# EAGLE schematic External Diagram FSAE 2022 (EAGLE 9.6.2)
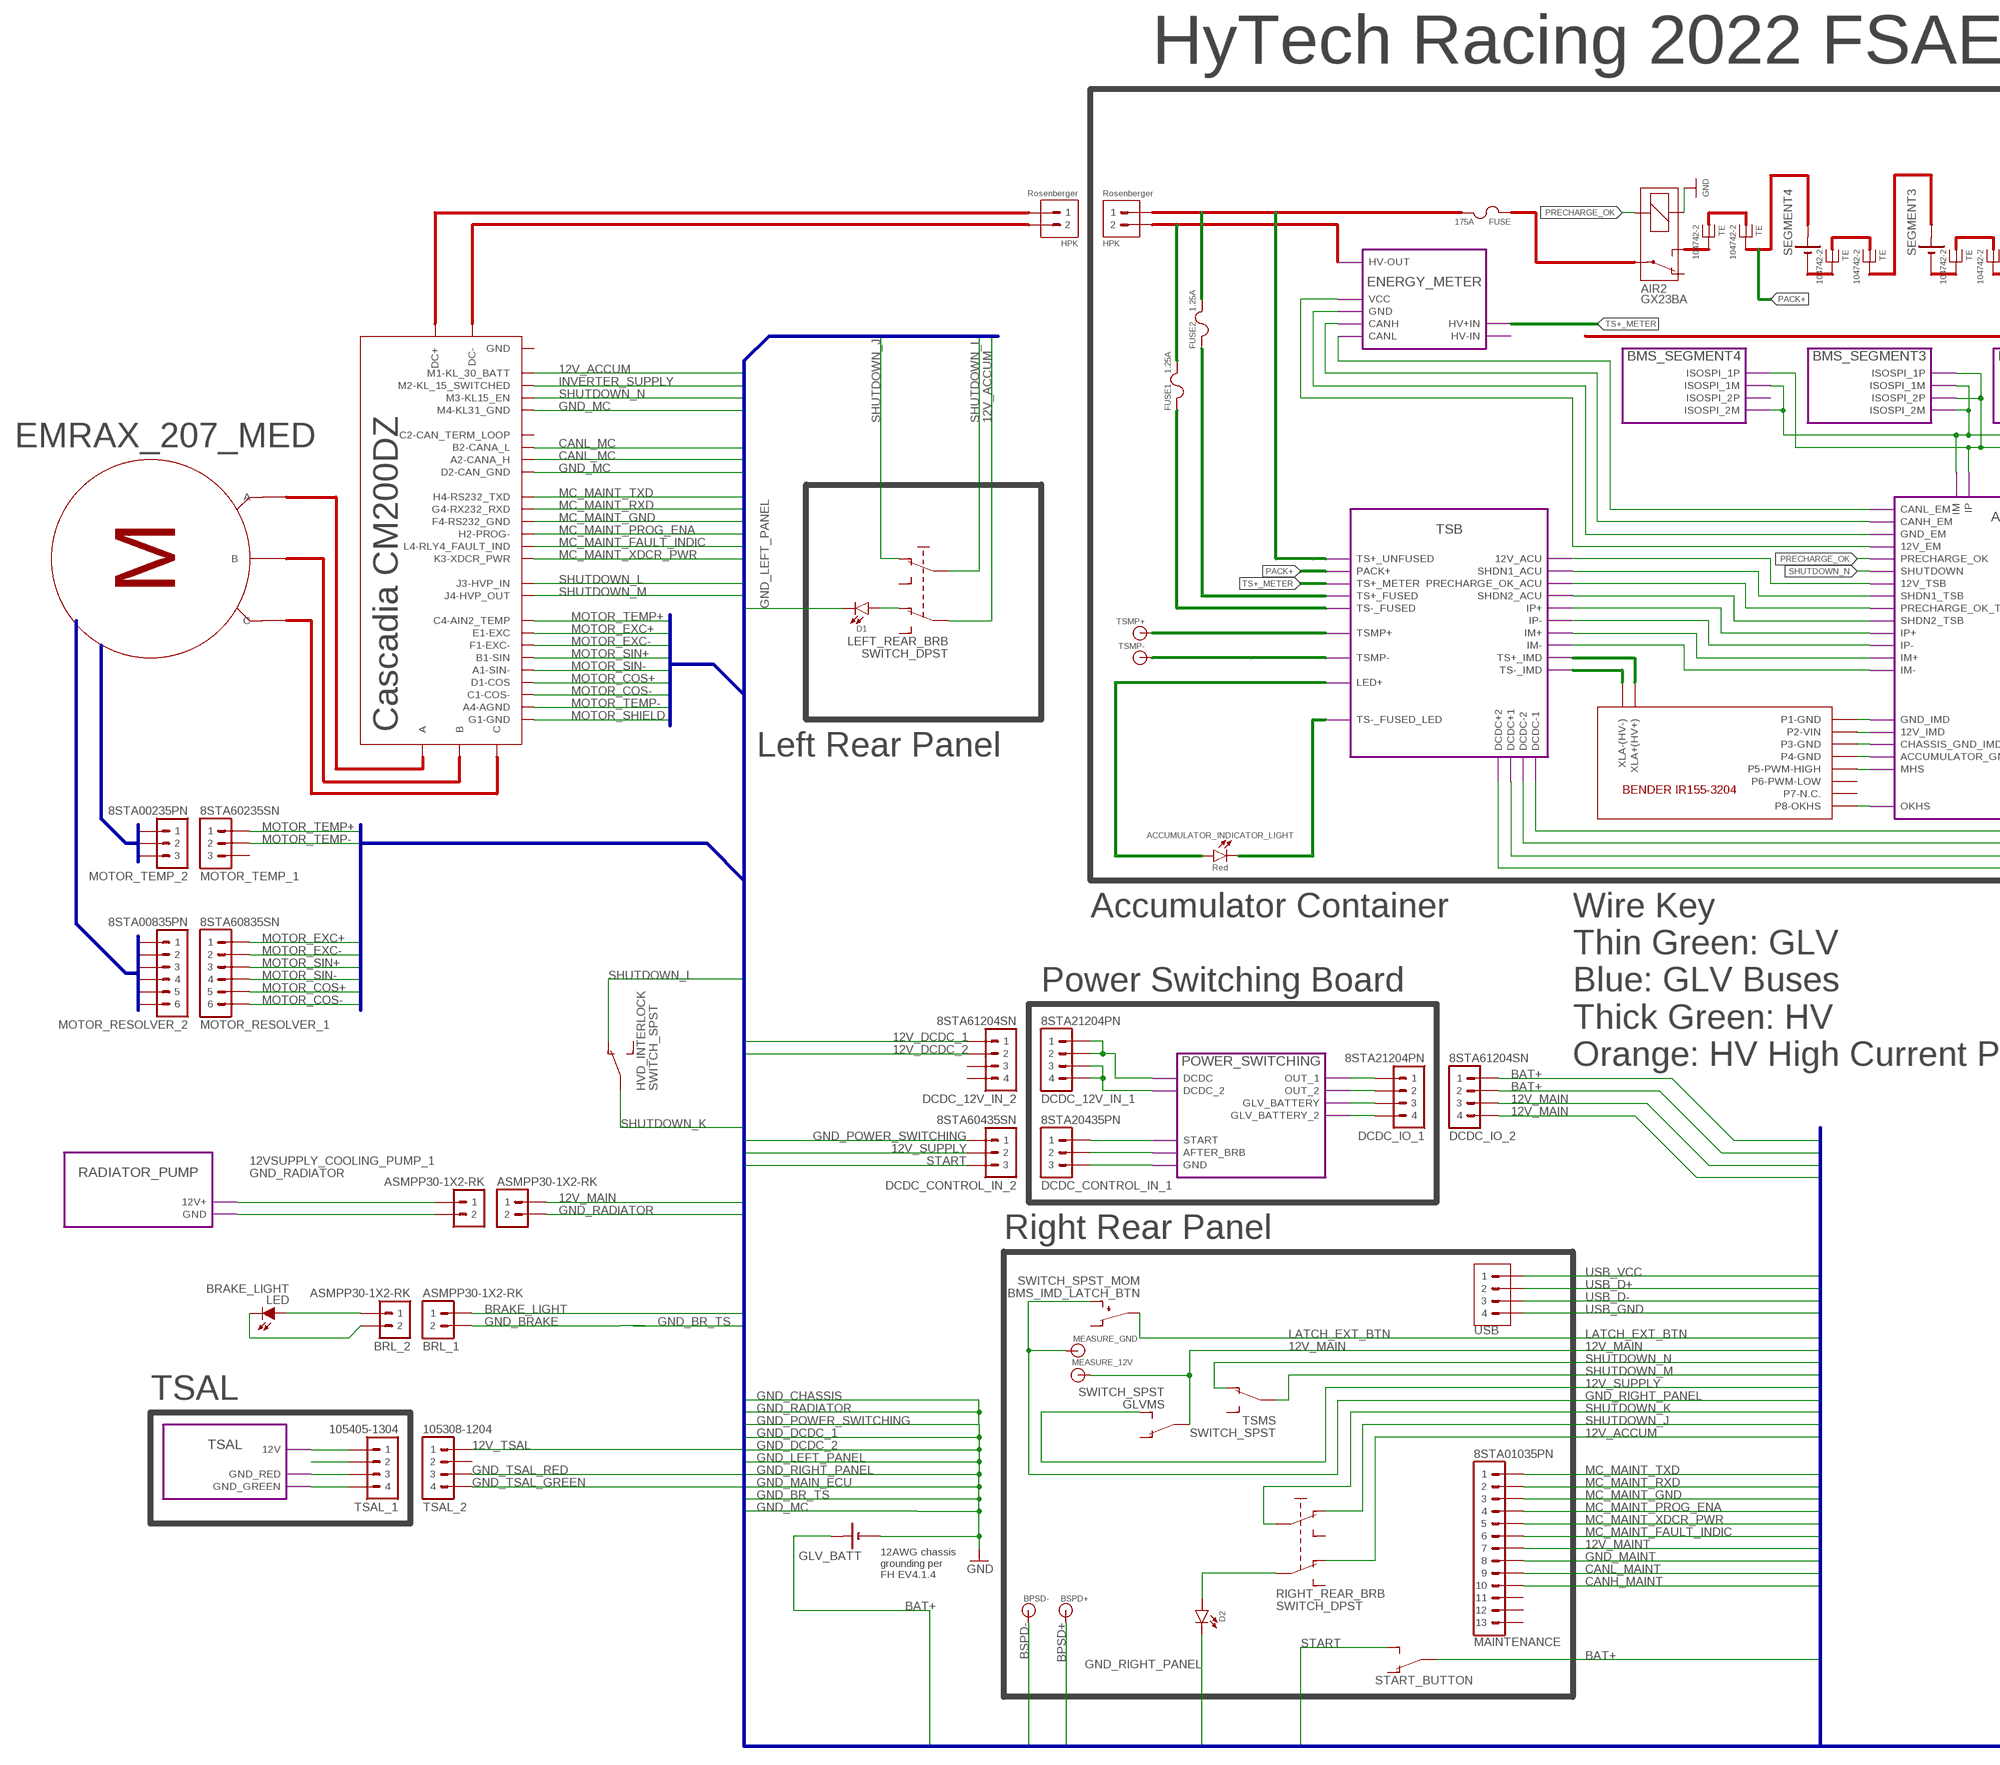
[diagram p0: schematic, sheet 1, part 1 of 2]
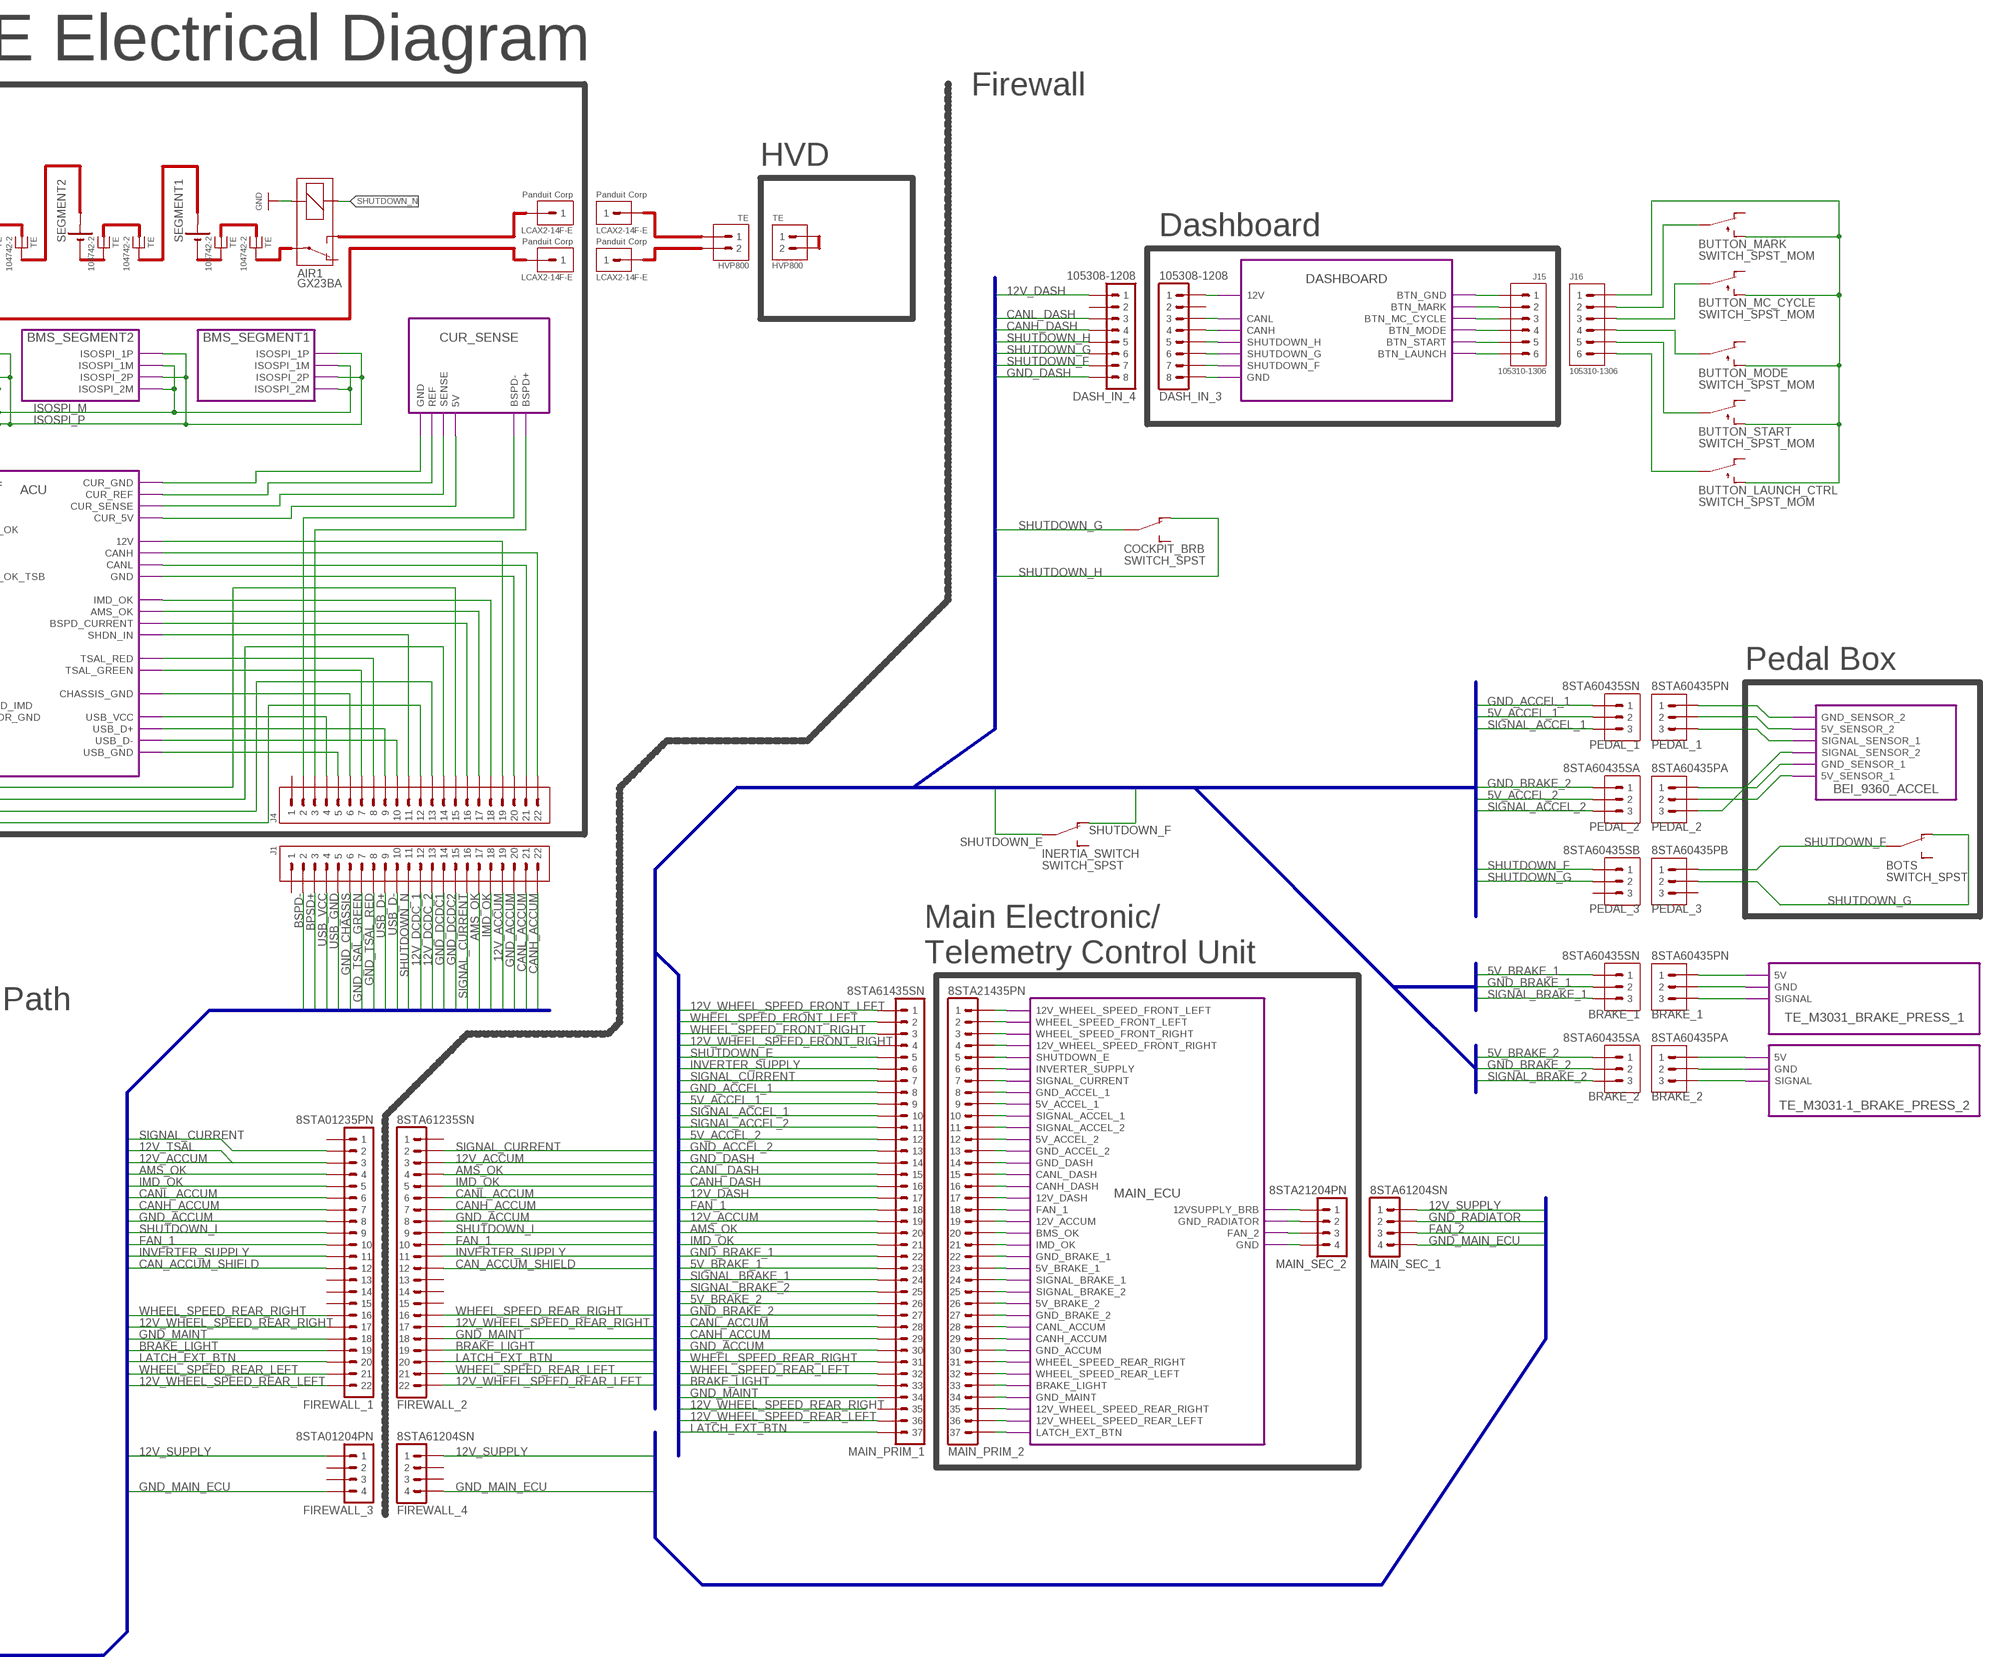
[diagram p1: schematic, sheet 1, part 2 of 2]

## Parts
A1  CASCADIA_CM200DZ  (no package)
ACCUMULATOR_INDICATOR_LIGHT  LED_0603_RED  [0603-LED]
AIR1  GX23BA  RELAY  (no package)
AIR2  GX23BA  RELAY  (no package)
BMS_IMD_LATCH_BTN  SWITCH_SPST_MOM  (no package)
BOTS  SWITCH_SPST  (no package)
BPSD-  BANANA_JACK  (no package)
BRAKE_LIGHT  LED  (no package)
BRL_1  ASMPP30-1X2-RK  M02  (no package)
BRL_2  ASMPP30-1X2-RK  M02  (no package)
BSPD+  BANANA_JACK  (no package)
BUTTON_LAUNCH_CTRL  SWITCH_SPST_MOM  (no package)
BUTTON_MARK  SWITCH_SPST_MOM  (no package)
BUTTON_MC_CYCLE  SWITCH_SPST_MOM  (no package)
BUTTON_MODE  SWITCH_SPST_MOM  (no package)
BUTTON_START  SWITCH_SPST_MOM  (no package)
COCKPIT_BRB  SWITCH_SPST  (no package)
D1  DIODE_LED  (no package)
D2  DIODE_LED  (no package)
DASH_IN_3  105308-1208  M08  (no package)
DASH_IN_4  105308-1208  M08  (no package)
DCDC_12V_IN_1  8STA21204PN  M04  (no package)
DCDC_12V_IN_2  8STA61204SN  M04  (no package)
DCDC_CONTROL_IN_1  8STA20435PN  M03  (no package)
DCDC_CONTROL_IN_2  8STA60435SN  M03  (no package)
DCDC_IO_1  8STA21204PN  M04  (no package)
DCDC_IO_2  8STA61204SN  M04  (no package)
EMRAX_207_MED  MOTOR_AC  (no package)
FIREWALL_1  8STA01235PN  M22  (no package)
FIREWALL_2  8STA61235SN  M22  (no package)
FIREWALL_3  8STA01204PN  M04  (no package)
FIREWALL_4  8STA61204SN  M04  (no package)
FUSE  175A  FUSE  (no package)
FUSE1  1.25A  FUSE  (no package)
FUSE2  1.25A  FUSE  (no package)
GLV_BATT  BATTERY_1_CELL  (no package)
GLVMS  SWITCH_SPST  (no package)
HVD_INTERLOCK  SWITCH_SPST  (no package)
INERTIA_SWITCH  SWITCH_SPST  (no package)
J1  CONNECTOR-22_SOURIAU_  [SOURIAU_12-35]
J2  CONNECTOR-4_  (no package)
J3  CONNECTOR-2_HVP800  (no package)
J4  CONNECTOR-22_SOURIAU_  [SOURIAU_12-35]
J5  CONNECTOR-3_  (no package)
J6  CONNECTOR-3_  (no package)
J7  CONNECTOR-3_  (no package)
J8  CONNECTOR-3_  (no package)
J9  CONNECTOR-3_  (no package)
J10  CONNECTOR-3_  (no package)
J11  CONNECTOR-3_  (no package)
J12  CONNECTOR-3_  (no package)
J13  CONNECTOR-3_  (no package)
J14  CONNECTOR-3_  (no package)
J15  CONNECTOR-6_NF_T_V_BLACK  [MOLEX_NANOFIT_PTH_06]
J16  CONNECTOR-6_NF_T_V_BLACK  [MOLEX_NANOFIT_PTH_06]
J17  CONNECTOR-2_HPK  (no package)
J18  CONNECTOR-2_HPK  (no package)
J19  CONNECTOR-1_LCAX2-14F-E  (no package)
J20  CONNECTOR-1_LCAX2-14F-E  (no package)
J21  CONNECTOR-1_LCAX2-14F-E  (no package)
J22  CONNECTOR-1_LCAX2-14F-E  (no package)
J23  CONNECTOR-2_HVP800  (no package)
LEFT_REAR_BRB  SWITCH_DPST  (no package)
MAIN_PRIM_1  8STA61435SN  M37  (no package)
MAIN_PRIM_2  8STA21435PN  M37  (no package)
MAIN_SEC_1  8STA61204SN  M04  (no package)
MAIN_SEC_2  8STA21204PN  M04  (no package)
MAINTENANCE  8STA01035PN  M13  (no package)
MEASURE_12V  BANANA_JACK  (no package)
MEASURE_GND  BANANA_JACK  (no package)
MOTOR_RESOLVER_1  8STA60835SN  M06  (no package)
MOTOR_RESOLVER_2  8STA00835PN  M06  (no package)
MOTOR_TEMP_1  8STA60235SN  M03  (no package)
MOTOR_TEMP_2  8STA00235PN  M03  (no package)
PUMP_1  ASMPP30-1X2-RK  M02  (no package)
PUMP_2  ASMPP30-1X2-RK  M02  (no package)
RIGHT_REAR_BRB  SWITCH_DPST  (no package)
S1  SWITCH_SPST_  (no package)
SEGMENT1  BATTERY_1_CELL  (no package)
SEGMENT2  BATTERY_1_CELL  (no package)
SEGMENT3  BATTERY_1_CELL  (no package)
SEGMENT4  BATTERY_1_CELL  (no package)
TSAL_1  105405-1304  M04  (no package)
TSAL_2  105308-1204  M04  (no package)
TSMP+  BANANA_JACK  (no package)
TSMP-  BANANA_JACK  (no package)
TSMS  SWITCH_SPST  (no package)
U$1  MAINTENANCE_PLUG_104742-2  (no package)
U$2  BENDER_IR155-3204  (no package)
U$3  MAINTENANCE_PLUG_104742-2  (no package)
U$4  MAINTENANCE_PLUG_104742-2  (no package)
U$5  MAINTENANCE_PLUG_104742-2  (no package)
U$6  MAINTENANCE_PLUG_104742-2  (no package)
U$7  MAINTENANCE_PLUG_104742-2  (no package)
U$8  MAINTENANCE_PLUG_104742-2  (no package)
U$9  MAINTENANCE_PLUG_104742-2  (no package)
U$10  MAINTENANCE_PLUG_104742-2  (no package)
U$11  MAINTENANCE_PLUG_104742-2  (no package)

## Module instances
BMS_SEGMENT2 = BMS_SEGMENT
BMS_SEGMENT3 = BMS_SEGMENT
BMS_SEGMENT4 = BMS_SEGMENT
RADIATOR_PUMP = COOLING_MODULE
MAIN_ECU = MAIN_ECU
BEI_9360_ACCEL = BEI_9360
TE_M3031_BRAKE_PRESS_1 = TE_M3031
POWER_SWITCHING = POWER_SWITCHING
TE_M3031-1_BRAKE_PRESS_2 = TE_M3031
ENERGY_METER = ENERGY_METER
ACU = ACU
DASHBOARD = DASHBOARD
BMS_SEGMENT1 = BMS_SEGMENT
TSB = TSB
TSAL = TSAL
CUR_SENSE = CUR_SENSE

## Nets
5V_ACCEL_1: J11.2 MAIN_PRIM_1.9 MAIN_PRIM_2.27 ; port MAIN_ECU.GND_BRAKE_2
5V_ACCEL_2: J12.2 MAIN_PRIM_1.12 MAIN_PRIM_2.28 ; port MAIN_ECU.CANL_ACCUM
5V_BRAKE: MAIN_PRIM_2.29 ; port MAIN_ECU.CANH_ACCUM
5V_BRAKE_1: J7.1 MAIN_PRIM_1.23
5V_BRAKE_2: J8.1 MAIN_PRIM_1.26
12V_ACCUM: A1.M1-KL_30_BATT FIREWALL_1.3 FIREWALL_2.3 J1.19 LEFT_REAR_BRB.P1 MAIN_PRIM_1.19 MAIN_PRIM_2.10 RIGHT_REAR_BRB.O1 ; port MAIN_ECU.SIGNAL_ACCEL_1
12V_DASH: DASH_IN_4.1 MAIN_PRIM_1.17 MAIN_PRIM_2.34 ; port MAIN_ECU.GND_MAINT
12V_DCDC_1: DCDC_12V_IN_2.1 J1.12
12V_DCDC_2: DCDC_12V_IN_2.2 J1.13
12V_MAIN: DCDC_IO_2.3 DCDC_IO_2.4 GLVMS.P MEASURE_12V.1 PUMP_1.1
12V_MAINT: MAINTENANCE.7
12V_SUPPLY: DCDC_CONTROL_IN_2.2 FIREWALL_3.1 FIREWALL_4.1 GLVMS.S MAIN_SEC_1.1 MAIN_SEC_2.1 ; port MAIN_ECU.12VSUPPLY_BRB
12V_TSAL: TSAL_2.1
12V_WHEEL_SPEED_FRONT_LEFT: MAIN_PRIM_1.1
12V_WHEEL_SPEED_FRONT_RIGHT: MAIN_PRIM_1.4
12V_WHEEL_SPEED_REAR_LEFT: FIREWALL_1.22 FIREWALL_2.22 MAIN_PRIM_1.36
12V_WHEEL_SPEED_REAR_RIGHT: FIREWALL_1.17 FIREWALL_2.17
12VSUPPLY_COOLING_PUMP_1: PUMP_2.1 ; port RADIATOR_PUMP.12V+
AMS_OK: FIREWALL_1.4 FIREWALL_2.4 J1.17 MAIN_PRIM_1.20
BAT+: DCDC_IO_2.1 DCDC_IO_2.2 GLV_BATT.+ S1.P
BPSD+: BSPD+.1 J1.3
BRAKE_LIGHT: BRAKE_LIGHT.C BRL_1.1 BRL_2.2 FIREWALL_1.19 FIREWALL_2.19 MAIN_PRIM_1.33 MAIN_PRIM_2.9 MAIN_PRIM_2.33 ; port MAIN_ECU.5V_ACCEL_1 MAIN_ECU.BRAKE_LIGHT
BSPD-: BPSD-.1 J1.2
CAN_ACCUM_SHIELD: FIREWALL_1.12 FIREWALL_2.12
CANH_ACCUM: FIREWALL_1.7 FIREWALL_2.7 J1.22 MAIN_PRIM_1.29 MAIN_PRIM_2.13 ; port MAIN_ECU.GND_ACCEL_2
CANH_DASH: DASH_IN_4.4 MAIN_PRIM_1.16
CANH_MAINT: MAINTENANCE.10
CANH_MC: MAIN_PRIM_2.12 ; port MAIN_ECU.5V_ACCEL_2
CANL_ACCUM: FIREWALL_1.6 FIREWALL_2.6 J1.21 MAIN_PRIM_1.28 MAIN_PRIM_2.26 ; port MAIN_ECU.5V_BRAKE_2
CANL_DASH: DASH_IN_4.3 MAIN_PRIM_1.15
CANL_MAINT: MAINTENANCE.9
CANL_MC: A1.A2-CANA_H A1.B2-CANA_L MAIN_PRIM_2.11 ; port MAIN_ECU.SIGNAL_ACCEL_2
DASH_1: MAIN_PRIM_2.1 ; port MAIN_ECU.12V_WHEEL_SPEED_FRONT_LEFT
DASH_4: MAIN_PRIM_2.4 ; port MAIN_ECU.12V_WHEEL_SPEED_FRONT_RIGHT
DASH_5: MAIN_PRIM_2.18 ; port MAIN_ECU.FAN_1
DASH_6: MAIN_PRIM_2.19 ; port MAIN_ECU.12V_ACCUM
DASH_8: MAIN_PRIM_2.21 ; port MAIN_ECU.IMD_OK
DASH_9: MAIN_PRIM_2.23 ; port MAIN_ECU.5V_BRAKE_1
DASH_11: MAIN_PRIM_2.6 ; port MAIN_ECU.INVERTER_SUPPLY
DASH_12: MAIN_PRIM_2.22 ; port MAIN_ECU.GND_BRAKE_1
FAN_1: FIREWALL_1.10 FIREWALL_2.10 MAIN_PRIM_1.18
FAN_2: MAIN_SEC_1.3 MAIN_SEC_2.3 ; port MAIN_ECU.FAN_2
GND: AIR1.2 AIR2.1 MAIN_SEC_2.4 ; port MAIN_ECU.GND
GND_ACCEL_1: J11.1 MAIN_PRIM_1.8 MAIN_PRIM_2.14 ; port MAIN_ECU.GND_DASH
GND_ACCEL_2: MAIN_PRIM_1.13 MAIN_PRIM_2.15 ; port MAIN_ECU.CANL_DASH
GND_ACCUM: FIREWALL_1.8 FIREWALL_2.8 J1.20 MAIN_PRIM_1.30 MAIN_PRIM_2.30 ; port MAIN_ECU.GND_ACCUM
GND_AUX: MAIN_PRIM_2.36 ; port MAIN_ECU.12V_WHEEL_SPEED_REAR_LEFT
GND_BR: BRAKE_LIGHT.A BRL_2.1
GND_BRAKE: BRL_1.2 MAIN_PRIM_2.16 ; port MAIN_ECU.CANH_DASH
GND_BRAKE_1: J7.2 MAIN_PRIM_1.22
GND_BRAKE_2: J8.2 J12.1 MAIN_PRIM_1.27
GND_CHASSIS: J1.6
GND_CURRENT: MAIN_SEC_2.2 ; port MAIN_ECU.GND_RADIATOR
GND_DASH: DASH_IN_4.8 MAIN_PRIM_1.14
GND_DCDC1: J1.14
GND_DCDC2: J1.15
GND_DCDC_2: GLV_BATT.- ; supply symbol labelled GND
GND_LEFT_PANEL: D1.C
GND_MAIN_ECU: FIREWALL_3.4 FIREWALL_4.4 MAIN_SEC_1.4
GND_MAINT: FIREWALL_1.18 FIREWALL_2.18 MAIN_PRIM_1.34 MAINTENANCE.8
GND_MC: A1.D2-CAN_GND A1.M4-KL31_GND
GND_POWER_SWITCHING: DCDC_CONTROL_IN_2.1
GND_RADIATOR: MAIN_SEC_1.2 PUMP_1.2 PUMP_2.2 ; port RADIATOR_PUMP.GND
GND_RIGHT_PANEL: BMS_IMD_LATCH_BTN.S D2.C MEASURE_GND.1
GND_TSAL_GREEN: J1.7 TSAL_2.4
GND_TSAL_RED: J1.8 TSAL_2.3
IMD_OK: FIREWALL_1.5 FIREWALL_2.5 J1.18 MAIN_PRIM_1.21
INVERTER_SUPPLY: A1.M2-KL_15_SWITCHED FIREWALL_1.11 FIREWALL_2.11 MAIN_PRIM_1.6 MAIN_PRIM_2.7 ; port MAIN_ECU.SIGNAL_CURRENT
ISOSPI_M: port BMS_SEGMENT2.ISOSPI_1M BMS_SEGMENT2.ISOSPI_2M BMS_SEGMENT4.ISOSPI_2M BMS_SEGMENT4.ISOSPI_1M BMS_SEGMENT3.ISOSPI_2M BMS_SEGMENT3.ISOSPI_1M ACU.IM
ISOSPI_P: port BMS_SEGMENT2.ISOSPI_1P BMS_SEGMENT2.ISOSPI_2P BMS_SEGMENT4.ISOSPI_1P BMS_SEGMENT3.ISOSPI_1P BMS_SEGMENT3.ISOSPI_2P ACU.IP
LATCH_EXT_BTN: BMS_IMD_LATCH_BTN.P FIREWALL_1.20 FIREWALL_2.20 MAIN_PRIM_1.37 MAIN_PRIM_2.37 ; port MAIN_ECU.LATCH_EXT_BTN
MC_MAINT_FAULT_INDIC: A1.L4-RLY4_FAULT_IND MAINTENANCE.6
MC_MAINT_GND: A1.F4-RS232_GND MAINTENANCE.3
MC_MAINT_PROG_ENA: A1.H2-PROG- MAINTENANCE.4
MC_MAINT_RXD: A1.G4-RX232_RXD MAINTENANCE.2
MC_MAINT_TXD: A1.H4-RS232_TXD MAINTENANCE.1
MC_MAINT_XDCR_PWR: A1.K3-XDCR_PWR MAINTENANCE.5
MOTOR_COS+: A1.D1-COS MOTOR_RESOLVER_1.5
MOTOR_COS-: A1.C1-COS- MOTOR_RESOLVER_1.6
MOTOR_EXC+: A1.E1-EXC MOTOR_RESOLVER_1.1
MOTOR_EXC-: A1.F1-EXC- MOTOR_RESOLVER_1.2
MOTOR_SHIELD: A1.G1-GND
MOTOR_SIN+: A1.B1-SIN MOTOR_RESOLVER_1.3
MOTOR_SIN-: A1.A1-SIN- MOTOR_RESOLVER_1.4
MOTOR_TEMP+: A1.C4-AIN2_TEMP MOTOR_TEMP_1.1
MOTOR_TEMP-: A1.A4-AGND MOTOR_TEMP_1.2
N$1: BUTTON_START.P J16.5
N$2: ACCUMULATOR_INDICATOR_LIGHT.2(A) ; port TSB.LED+
N$3: TSAL_1.1
N$4: TSAL_1.2
N$5: J4.4 ; port ACU.USB_VCC
N$6: J4.13 ; port TSB.DCDC+1
N$7: D1.A LEFT_REAR_BRB.O1
N$8: port ACU.12V_TSB TSB.12V_ACU
N$9: port ACU.SHDN1_TSB TSB.SHDN1_ACU
N$10: J4.15 ; port TSB.DCDC-1
N$11: J4.12 ; port TSB.DCDC+2
N$12: J5.1 ; port TE_M3031_BRAKE_PRESS_1.5V
N$13: J5.2 ; port TE_M3031_BRAKE_PRESS_1.GND
N$14: J5.3 ; port TE_M3031_BRAKE_PRESS_1.SIGNAL
N$15: DASH_IN_3.1 ; port DASHBOARD.12V
N$16: J6.1 ; port TE_M3031-1_BRAKE_PRESS_2.5V
N$17: D2.A RIGHT_REAR_BRB.P1
N$18: DASH_IN_3.3 ; port DASHBOARD.CANL
N$19: DASH_IN_3.4 ; port DASHBOARD.CANH
N$20: ACCUMULATOR_INDICATOR_LIGHT.1(C) ; port TSB.TS-_FUSED_LED
N$21: DASH_IN_3.5 ; port DASHBOARD.SHUTDOWN_H
N$22: DASH_IN_3.6 ; port DASHBOARD.SHUTDOWN_G
N$23: DASH_IN_3.7 ; port DASHBOARD.SHUTDOWN_F
N$25: J4.5 ; port ACU.USB_GND
N$26: J4.14 ; port TSB.DCDC-2
N$27: J15.1 ; port DASHBOARD.BTN_GND
N$28: J15.2 ; port DASHBOARD.BTN_MARK
N$29: J15.3 ; port DASHBOARD.BTN_MC_CYCLE
N$30: J15.4 ; port DASHBOARD.BTN_MODE
N$31: J15.5 ; port DASHBOARD.BTN_START
N$32: J15.6 ; port DASHBOARD.BTN_LAUNCH
N$35: port ACU.PRECHARGE_OK_TSB TSB.PRECHARGE_OK_ACU
N$36: J9.1 ; port BEI_9360_ACCEL.GND_SENSOR_2
N$37: J6.2 ; port TE_M3031-1_BRAKE_PRESS_2.GND
N$38: port ACU.SHDN2_TSB TSB.SHDN2_ACU
N$39: J4.3 ; port CUR_SENSE.BSPD+
N$40: J4.2 ; port CUR_SENSE.BSPD-
N$41: BUTTON_MODE.P J16.4
N$42: port ACU.IP+ TSB.IP+
N$43: BUTTON_MC_CYCLE.P J16.3
N$44: port ACU.IP- TSB.IP-
N$45: port ACU.IM+ TSB.IM+
N$46: port ACU.IM- TSB.IM-
N$47: BUTTON_LAUNCH_CTRL.S BUTTON_MARK.S BUTTON_MC_CYCLE.S BUTTON_MODE.S BUTTON_START.S J16.1
N$48: BUTTON_MARK.P J16.2
N$49: BUTTON_LAUNCH_CTRL.P J16.6
N$50: J6.3 ; port TE_M3031-1_BRAKE_PRESS_2.SIGNAL
N$51: J9.2 ; port BEI_9360_ACCEL.5V_SENSOR_2
N$52: J9.3 ; port BEI_9360_ACCEL.SIGNAL_SENSOR_1
N$53: J10.1 ; port BEI_9360_ACCEL.GND_SENSOR_1
N$54: J4.9 ; port ACU.USB_D+
N$55: J10.2 ; port BEI_9360_ACCEL.5V_SENSOR_1
N$56: J10.3 ; port BEI_9360_ACCEL.SIGNAL_SENSOR_2
N$57: DASH_IN_3.8 ; port DASHBOARD.GND
N$58: J4.10 ; port ACU.USB_D-
N$59: J4.6 ; port ACU.CHASSIS_GND
N$60: port ENERGY_METER.VCC ACU.12V_EM
N$61: FUSE2.2
N$62: FUSE1.2
N$63: FUSE2.1 ; port TSB.TS+_FUSED
N$64: DCDC_12V_IN_1.3 DCDC_12V_IN_1.4 ; port POWER_SWITCHING.DCDC_2
N$65: DCDC_12V_IN_1.1 DCDC_12V_IN_1.2 ; port POWER_SWITCHING.DCDC
N$66: DCDC_IO_1.1 ; port POWER_SWITCHING.OUT_1
N$67: DCDC_IO_1.2 ; port POWER_SWITCHING.OUT_2
N$68: FUSE1.1 ; port TSB.TS-_FUSED
N$69: DCDC_CONTROL_IN_1.3 ; port POWER_SWITCHING.GND
N$70: DCDC_CONTROL_IN_1.2 ; port POWER_SWITCHING.AFTER_BRB
N$71: DCDC_CONTROL_IN_1.1 ; port POWER_SWITCHING.START
N$72: U$2.XLA+(HV+) ; port TSB.TS+_IMD
N$73: DCDC_IO_1.3 ; port POWER_SWITCHING.GLV_BATTERY
N$74: J4.11 ; port ACU.SHDN_IN
N$75: port ACU.CUR_5V CUR_SENSE.5V
N$76: U$2.XLA-(HV-) ; port TSB.TS-_IMD
N$77: MAIN_PRIM_2.35 ; port MAIN_ECU.12V_WHEEL_SPEED_REAR_RIGHT
N$78: port ENERGY_METER.CANL ACU.CANL_EM
N$79: TSMP+.1 ; port TSB.TSMP+
N$80: DCDC_IO_1.4 ; port POWER_SWITCHING.GLV_BATTERY_2
N$81: TSAL_1.3
N$82: TSAL_1.4
N$83: J4.7 ; port ACU.TSAL_GREEN
N$84: J4.8 ; port ACU.TSAL_RED
N$86: J4.16 ; port ACU.BSPD_CURRENT
N$87: J4.17 ; port ACU.AMS_OK
N$88: J4.18 ; port ACU.IMD_OK
N$89: J4.19 ; port ACU.12V
N$90: J4.22 ; port ACU.CANH
N$91: J4.21 ; port ACU.CANL
N$92: J4.20 ; port ACU.GND
N$97: U$2.P1-GND ; port ACU.GND_IMD
N$98: U$2.P2-VIN ; port ACU.12V_IMD
N$99: U$2.P3-GND ; port ACU.CHASSIS_GND_IMD
N$100: U$2.P4-GND ; port ACU.ACCUMULATOR_GND
N$101: U$2.P5-PWM-HIGH ; port ACU.MHS
N$102: U$2.P8-OKHS ; port ACU.OKHS
N$103: TSMP-.1 ; port TSB.TSMP-
N$104: port ENERGY_METER.GND ACU.GND_EM
N$105: port ENERGY_METER.CANH ACU.CANH_EM
N$106: port ACU.CUR_SENSE CUR_SENSE.SENSE
N$107: port ACU.CUR_REF CUR_SENSE.REF
N$108: port ACU.CUR_GND CUR_SENSE.GND
PACK+: port TSB.PACK+
PRECHARGE_OK: AIR2.2 ; port ACU.PRECHARGE_OK
RET_FAN_1: MAIN_PRIM_2.17 ; port MAIN_ECU.12V_DASH
SHUTDOWN_E: INERTIA_SWITCH.P MAIN_PRIM_1.5 MAIN_PRIM_2.5 ; port MAIN_ECU.SHUTDOWN_E
SHUTDOWN_F: BOTS.P DASH_IN_4.7 INERTIA_SWITCH.O J13.1 J14.1
SHUTDOWN_G: BOTS.O COCKPIT_BRB.P DASH_IN_4.6 J13.2 J14.2
SHUTDOWN_H: COCKPIT_BRB.O DASH_IN_4.5
SHUTDOWN_I: FIREWALL_1.9 FIREWALL_2.9 LEFT_REAR_BRB.P
SHUTDOWN_J: LEFT_REAR_BRB.O RIGHT_REAR_BRB.O
SHUTDOWN_K: HVD_INTERLOCK.P RIGHT_REAR_BRB.P
SHUTDOWN_L: A1.J3-HVP_IN HVD_INTERLOCK.O
SHUTDOWN_M: A1.J4-HVP_OUT TSMS.P
SHUTDOWN_N: A1.M3-KL15_EN AIR1.1 J1.11 TSMS.O ; port ACU.SHUTDOWN
SIGNAL_ACCEL_1: J11.3 MAIN_PRIM_1.10
SIGNAL_ACCEL_2: J12.3 MAIN_PRIM_1.11
SIGNAL_BRAKE: MAIN_PRIM_2.8 ; port MAIN_ECU.GND_ACCEL_1
SIGNAL_BRAKE_1: J7.3 MAIN_PRIM_1.24 MAIN_PRIM_2.24 ; port MAIN_ECU.SIGNAL_BRAKE_1
SIGNAL_BRAKE_2: J8.3 MAIN_PRIM_1.25 MAIN_PRIM_2.25 ; port MAIN_ECU.SIGNAL_BRAKE_2
SIGNAL_CURRENT: FIREWALL_1.2 FIREWALL_2.2 J1.16 MAIN_PRIM_1.7
START: DCDC_CONTROL_IN_2.3 S1.S
TS+_METER: port TSB.TS+_METER ENERGY_METER.HV+IN
TS+_UNFUSED: port TSB.TS+_UNFUSED
USB_D+: J1.9 J2.2
USB_D-: J1.10 J2.3
USB_GND: J1.5 J2.4
USB_VCC: J1.4 J2.1
WHEEL_SPEED_2: MAIN_PRIM_2.2 MAIN_PRIM_2.3 ; port MAIN_ECU.WHEEL_SPEED_FRONT_LEFT MAIN_ECU.WHEEL_SPEED_FRONT_RIGHT
WHEEL_SPEED_3: MAIN_PRIM_2.20 MAIN_PRIM_2.31 ; port MAIN_ECU.WHEEL_SPEED_REAR_RIGHT MAIN_ECU.BMS_OK
WHEEL_SPEED_4: MAIN_PRIM_2.32 ; port MAIN_ECU.WHEEL_SPEED_REAR_LEFT
WHEEL_SPEED_FRONT_LEFT: MAIN_PRIM_1.2
WHEEL_SPEED_FRONT_RIGHT: MAIN_PRIM_1.3
WHEEL_SPEED_REAR_LEFT: FIREWALL_1.21 FIREWALL_2.21 MAIN_PRIM_1.32
WHEEL_SPEED_REAR_RIGHT: FIREWALL_1.16 FIREWALL_2.16 MAIN_PRIM_1.31
Unconnected: A1.A A1.B A1.C A1.C2-CAN_TERM_LOOP A1.DC+ A1.DC- A1.GND AIR1.O AIR1.P AIR1.S AIR2.O AIR2.P AIR2.S BMS_IMD_LATCH_BTN.O BOTS.S BUTTON_LAUNCH_CTRL.O BUTTON_MARK.O BUTTON_MC_CYCLE.O BUTTON_MODE.O BUTTON_START.O COCKPIT_BRB.S DASH_IN_3.2 DASH_IN_4.2 DCDC_12V_IN_2.3 DCDC_12V_IN_2.4 EMRAX_207_MED.A EMRAX_207_MED.B EMRAX_207_MED.C FIREWALL_1.1 FIREWALL_1.13 FIREWALL_1.14 FIREWALL_1.15 FIREWALL_2.1 FIREWALL_2.13 FIREWALL_2.14 FIREWALL_2.15 FIREWALL_3.2 FIREWALL_3.3 FIREWALL_4.2 FIREWALL_4.3 FUSE.1 FUSE.2 GLVMS.O HVD_INTERLOCK.S INERTIA_SWITCH.S J1.1 J3.1 J3.2 J4.1 J13.3 J14.3 J17.1 J17.2 J18.1 J18.2 J19.1 J20.1 J21.1 J22.1 J23.1 J23.2 LEFT_REAR_BRB.S LEFT_REAR_BRB.S1 MAIN_PRIM_1.35 MAINTENANCE.11 MAINTENANCE.12 MAINTENANCE.13 MOTOR_RESOLVER_2.1 MOTOR_RESOLVER_2.2 MOTOR_RESOLVER_2.3 MOTOR_RESOLVER_2.4 MOTOR_RESOLVER_2.5 MOTOR_RESOLVER_2.6 MOTOR_TEMP_1.3 MOTOR_TEMP_2.1 MOTOR_TEMP_2.2 MOTOR_TEMP_2.3 RIGHT_REAR_BRB.S RIGHT_REAR_BRB.S1 S1.O SEGMENT1.+ SEGMENT1.- SEGMENT2.+ SEGMENT2.- SEGMENT3.+ SEGMENT3.- SEGMENT4.+ SEGMENT4.- TSAL_2.2 TSMS.S U$1.1 U$1.P$1 U$2.P6-PWM-LOW U$2.P7-N.C. U$3.1 U$3.P$1 U$4.1 U$4.P$1 U$5.1 U$5.P$1 U$6.1 U$6.P$1 U$7.1 U$7.P$1 U$8.1 U$8.P$1 U$9.1 U$9.P$1 U$10.1 U$10.P$1 U$11.1 U$11.P$1

## Buses
5V_ACCEL_1,5V_ACCEL_2,5V_BRAKE,5V_BRAKE_1,5V_BRAKE_2,12V_ACCUM_MAINT,12V_AFTER_LEFT_BRB,12V_DASH,12V_DCDC_1,12V_DCDC_2,12V_MAIN,12V_MAINT,12V_MC,12V_SUPPLY,12VSUPPLY_COOLING_FAN_1,12VSUPPLY_COOLING_FAN_2,12VSUPPLY_COOLING_FAN_3,12VSUPPLY_COOLING_PUMP_1,12VSUPPLY_COOLING_UNSWITCHED,12VSUPPLY_UNSWITCHED,12V_TSAL,12V_WHEEL_SPEED_FRONT_LEFT,12V_WHEEL_SPEED_FRONT_RIGHT,12V_WHEEL_SPEED_REAR_LEFT,12V_WHEEL_SPEED_REAR_RIGHT,60V_THRESHOLD,60V_THRESHOLD_1,60V_THRESHOLD_2,AMS_OK,BAT+,BPSD+,BRAKE_LIGHT,BSPD-,CAN_ACCUM_SHIELD,CANH_ACCUM,CANH_DASH,CANH_FRONT,CANH_MAINT,CANH_MC,CANL_ACCUM,CANL_DASH,CANL_MAINT,CANL_MC,CHARGE_ENABLE,CUR_SENSE_5V,CUR_SENSE_CUR_SENSE,CUR_SENSE_GND,CUR_SENSE_REF,DASH_1,DASH_4,DASH_5,DASH_8,DASH_9,DASH_11,DASH_12,FAN_1,FAN_2,GND,GND_ACCEL_1,GND_ACCEL_2,GND_ACCUM,GND_AUX,GND_BR,GND_BRAKE,GND_BRAKE_1,GND_BRAKE_2,GND_BR_TS,GND_CHASSIS,GND_CURRENT,GND_DASH,GND_DCDC1,GND_DCDC_1,GND_DCDC_2,GND_DCDC2,GND_DCDC_4,GND_LEFT_PANEL,GND_MAIN_ECU,GND_MAINT,GND_MC,GND_POWER_SWITCHING,GND_RIGHT_PANEL,GND_SHIELD,GND_TSAL_GREEN,GND_TSAL_RED,HV+,HV-,HV+FUSED,HV-FUSED,IMD_GND,IMD_HV+,IMD_HV-,IMD_OK,IMD_SUPPLY,INVERTER_SUPPLY,ISOSPI_M,ISOSPI_P,LATCH_EXT_BTN,MC_MAINT_FAULT_INDIC,MC_MAINT_GND,MC_MAINT_PROG_ENA,MC_MAINT_RXD,MC_MAINT_TXD,MC_MAINT_XDCR_PWR,MOTOR_COS-,MOTOR_COS+,MOTOR_EXC-,MOTOR_EXC+,MOTOR_SHIELD,MOTOR_SIN-,MOTOR_SIN+,MOTOR_TEMP+,MOTOR_TEMP-,RET_FAN_1,SHUTDOWN_E,SHUTDOWN_F,SHUTDOWN_G,SHUTDOWN_H,SHUTDOWN_I,SHUTDOWN_J,SHUTDOWN_K,SHUTDOWN_K_OUT,SHUTDOWN_L,SHUTDOWN_M,SHUTDOWN_N,SIGNAL_ACCEL_1,SIGNAL_ACCEL_2,SIGNAL_BRAKE,SIGNAL_BRAKE_1,SIGNAL_BRAKE_2,SIGNAL_CURRENT,SSOK,START,USB_D-,USB_D+,USB_GND,USB_VCC,WHEEL_SPEED_2,WHEEL_SPEED_3,WHEEL_SPEED_4,WHEEL_SPEED_FRONT_LEFT,WHEEL_SPEED_FRONT_RIGHT,WHEEL_SPEED_REAR_LEFT,WHEEL_SPEED_REAR_RIGHT
B$1
B$2
HT:5V_ACCEL_1,5V_ACCEL_2,5V_BRAKE,12V_ACCUM,12V_ACCUM_MAINT,12V_DASH,12V_MAINT,12V_SUPPLY,12VSUPPLY_COOLING_FAN_1,12VSUPPLY_COOLING_FAN_2,12VSUPPLY_COOLING_PUMP_1,12VSUPPLY_COOLING_UNSWITCHED,12VSUPPLY_UNSWITCHED,BAT+,BRAKE_LIGHT,CANH_ACCUM,CANH_FRONT,CANH_MAINT,CANH_MC,CANL_ACCUM,CANL_FRONT,CANL_MAINT,CANL_MC,CHARGE_ENABLE,DASH_1,DASH_4,DASH_5,DASH_6,DASH_8,DASH_9,DASH_12,FAN_2,GND_ACCEL_1,GND_ACCEL_2,GND_ACCUM,GND_ACCUM_RELAYS,GND_BRAKE,GND_BR_TS,GND_CURRENT,GND_DASH,GND_LEFT_PANEL,GND_MAIN_ECU,GND_MAINT,GND_MC,GND_RIGHT_PANEL,GND_SHIELD,INVERTER_SUPPLY,LATCH_EXT_BTN,MC_MAINT_GND,MC_MAINT_PROG_ENA,MC_MAINT_RXD,MC_MAINT_TXD,MC_MAINT_XDCR_PWR,MOTOR_COS-,MOTOR_COS+,MOTOR_EXC-,MOTOR_EXC+,MOTOR_SHIELD,MOTOR_SIN+,MOTOR_SIN-,MOTOR_TEMP+,MOTOR_TEMP-,RET_FAN_1,SHUTDOWN_F,SHUTDOWN_G,SIGNAL_BRAKE,SIGNAL_BRAKE_1,SIGNAL_BRAKE_2,SSOK,TSAL,WHEEL_SPEED_2,WHEEL_SPEED_3,WHEEL_SPEED_4

## Notes on the sheet
- HyTech Racing 2022 FSAE Electrical Diagram
- Firewall
- HVD
- Dashboard
- Pedal Box
- 8STA60435SN | 8STA60435PN
- Left Rear Panel
- PEDAL_1 | PEDAL_1
- 8STA60435SA | 8STA60435PA
- PEDAL_2 | PEDAL_2
- 8STA60435SB | 8STA60435PB
- Accumulator Container
- PEDAL_3 | PEDAL_3
- Power Switching Board
- 8STA60435SN | 8STA60435PN
- Main Electronic/
  Telemetry Control Unit
- Wire Key
  Thin Green: GLV
  Blue: GLV Buses
  Thick Green: HV
  Orange: HV High Current Path
- BRAKE_1 | BRAKE_1
- 8STA60435SA | 8STA60435PA
- BRAKE_2 | BRAKE_2
- Right Rear Panel
- USB
- TSAL | GND_CHASSIS
- GND_RADIATOR
- 12AWG chassis
  grounding per
  FH EV4.1.4
- START_BUTTON

## Library data of the parts
A1 = HyTechSymbolsTemp:CASCADIA_CM200DZ: Cascaida Motion CM200DZ Motor Inverter Product Page <https://www.cascadiamotion.com/productlist/8-inverters/pm-inverters/49-cm200> Datasheet <https://www.cascadiamotion.com/images/catalog/DataSheets/CM200.pdf>
ACCUMULATOR_INDICATOR_LIGHT = HyTechDevices:LED_?_*: LED Blue <https://www.mouser.com/datasheet/2/216/APT1608VBC_D-246010.pdf> Green <https://www.mouser.com/datasheet/2/216/APT1608ZGCK-1173388.pdf> Orange <https://www.mouser.com/datasheet/2/216/APT1608SECK-6197.pdf> Red <https://www.mouser.com/datasheet/2/216/APT1608SECK-J3-PRV-1173336.pdf> White <https://www.mouser.com/datasheet/2/50/SM0603UWC-880813.pdf> Yellow <https://www.mouser.com/datasheet/2/216/APT1608SYCK-J3-PRV-1173311.pdf>; COLOR: Red; DKPN: 754-1786-1-ND; MANUFACTURER: Kingbright; MOPN: 604-APT1608SECKJ3PRV; MPN: APT1608SECK/J3-PRV
AIR1 AIR2 = HyTechSymbols:RELAY: RELAY 1 x switch
BMS_IMD_LATCH_BTN BUTTON_LAUNCH_CTRL BUTTON_MARK BUTTON_MC_CYCLE BUTTON_MODE BUTTON_START = HyTechSymbols:SWITCH_SPST_MOM: Single Pull Single Throw Switch Momentary
BOTS COCKPIT_BRB GLVMS HVD_INTERLOCK INERTIA_SWITCH TSMS = HyTechSymbols:SWITCH_SPST: Single Pull Single Throw Switch
BPSD- BSPD+ MEASURE_12V MEASURE_GND TSMP+ TSMP- = HyTechSymbols:BANANA_JACK: Banana Jack Purchasing: Mouser - Red <http://www.mouser.com/ProductDetail/Pomona-Electronics/72930-2/?qs=2nDnb8a6ouM2t6dPw1JBow%3D%3D> Mouser - Black <http://www.mouser.com/ProductDetail/Pomona-Electronics/72930-0/?qs=2nDnb8a6ouNpA2wl9kKnzA%3D%3D>
BRAKE_LIGHT = HyTechSymbols:LED: Generic LED
BRL_1 BRL_2 PUMP_1 PUMP_2 = HyTechSymbols:M02: Generic 2-pin connector
D1 D2 = HyTechSymbolsTemp:DIODE_LED
DASH_IN_3 DASH_IN_4 = HyTechSymbols:M08: Generic 8-pin connector
DCDC_12V_IN_1 DCDC_12V_IN_2 DCDC_IO_1 DCDC_IO_2 FIREWALL_3 FIREWALL_4 MAIN_SEC_1 MAIN_SEC_2 TSAL_1 TSAL_2 = HyTechSymbols:M04: Generic 4-pin connector
DCDC_CONTROL_IN_1 DCDC_CONTROL_IN_2 MOTOR_TEMP_1 MOTOR_TEMP_2 = HyTechSymbols:M03: Generic 3-pin connector
EMRAX_207_MED = HyTechSymbols:MOTOR_AC: Generic three-phase AC electric motor
FIREWALL_1 FIREWALL_2 = HyTechSymbols:M22: Generic 22-pin connector
FUSE FUSE1 FUSE2 = HyTechSymbols:FUSE: Generic Fuse
GLV_BATT SEGMENT1-SEGMENT4 = HyTechSymbols:BATTERY_1_CELL: Generic 1-cell battery Source: Sonnenschein
J1 J4 = HyTechDevicesTemp:CONNECTOR-22_?_*: 22 pin connector; MANUFACTURER: SOURIAU
J2 = HyTechSymbolsTemp:CONNECTOR-4_*: Four pin connector Micro-Fit 3.0 <https://drive.google.com/file/d/1Be8WGxzm3IeOWSN4qfSP8J4bwHUWCwaO/view>
J3 J23 = HyTechSymbolsTemp:CONNECTOR-2_*: Two pin connector EVH2-N2TK-TDA <https://drive.google.com/file/d/1gQfuywpa-Tm7bohh-tcSjjxbyqcnD_h9/view> HPK <https://drive.google.com/file/d/1jTQMZ26zoHotHQHZYMoMT2jUzRt664sO/view> HVP800 <https://drive.google.com/file/d/1j-HswfqYHj8usJ9E3bf8NWBzB-X0BKJ4/view>; MANUFACTURER: TE; MPN: HVP800
J5-J14 = HyTechSymbolsTemp:CONNECTOR-3_*: Three pin connector HV02-M3S(40A)-M00A-1 <https://drive.google.com/file/d/14-0BdluqhzWVuxobIuHQclYd8S9S8AFy/view> NEMA-5-20 <https://drive.google.com/file/d/1QyRJhkZq4Jge6F64jD-5aG-LjfEdAoZD/view>
J15 J16 = HyTechDevices:CONNECTOR-6_?_*: 6 Pin Connector; DKPN: WM15062-ND; MANUFACTURER: Molex; MOPN: 538-105310-1306; MPN: 105310-1306
J17 J18 = HyTechSymbolsTemp:CONNECTOR-2_*: Two pin connector EVH2-N2TK-TDA <https://drive.google.com/file/d/1gQfuywpa-Tm7bohh-tcSjjxbyqcnD_h9/view> HPK <https://drive.google.com/file/d/1jTQMZ26zoHotHQHZYMoMT2jUzRt664sO/view> HVP800 <https://drive.google.com/file/d/1j-HswfqYHj8usJ9E3bf8NWBzB-X0BKJ4/view>; MANUFACTURER: Rosenberger; MPN: HPK
J19-J22 = HyTechSymbolsTemp:CONNECTOR-1_*: Single pin connector CT2242-2 <https://drive.google.com/file/d/1rFz1F44pFGMLks1TuzNftb-wQBk0xWUD/view> LCAX2-14F-E <https://drive.google.com/file/d/1bbvHAAOUtBwm4fAPUWES_iBsARNVuAgN/view>; MANUFACTURER: Panduit Corp; MPN: LCAX2-14F-E
LEFT_REAR_BRB RIGHT_REAR_BRB = HyTechSymbols:SWITCH_DPST: Double Pull Single Throw Switch
MAIN_PRIM_1 MAIN_PRIM_2 = HyTechSymbols:M37: Generic 37-pin connector
MAINTENANCE = HyTechSymbols:M13: Generic 13-pin connector
MOTOR_RESOLVER_1 MOTOR_RESOLVER_2 = HyTechSymbols:M06: Generic 6-pin connector
S1 = HyTechSymbols:SWITCH_SPST_*: Single Pull Single Throw Switch EAO Series 45 40mm Illuminated Emergency Stop Swtich <https://hmi.eao.com/p/965f6719> EAO Series 45 34mm Illuminated Emergency Stop Switch <https://hmi.eao.com/p/5909b34f> TE Battery Disconnector Switch <https://www.mouser.com/datasheet/2/418/8/ENG_CD_35_210_100_R_900_5-2533843.pdf>
U$1 U$3-U$11 = HyTechSymbolsTemp:MAINTENANCE_PLUG_*; MANUFACTURER: TE; MPN: 104742-2
U$2 = HyTechSymbols:BENDER_IR155-3204: Bender IR155-3204 Insulation Monitoring Device Datasheet <http://www.bender-es.com/fileadmin/products/doc/IR155-32xx-V004_D00115_D_XXEN.pdf>

## Module HV_BOARD
Ports: 60V_THRESHOLD(out) IMD_SUPPLY(pwr) IMD_GND(pwr) IMD_HV+(nc) IMD_HV-(nc) HV+UNFUSED(pwr) HV-UNFUSED(pwr) 12VSUPPLY(pwr) BMS_OK_OUT(out) HV+FUSED(pwr) HV-FUSED(pwr) SHUTDOWN_K_OUT(out) SHUTDOWN_K_IN(in) SHUTDOWN_I_OUT(out) IMD_OK(in) IMD_OK_OUT(out) CHARGE_ENABLE(out) DISCHARGE+(out) DISCHARGE-(in) ISOSPI_P(io) ISOSPI_M(io) CUR_5V_1(pwr) CUR_SENSE_RAW_1(in) TEMP_SENSE_RAW_1(in) CUR_GND_1(pwr) GND(pwr) SIGNAL_CURRENT(out) SHUTDOWN_I_IN(in) CANH(io) CANL(io) INDICATOR+(out) INDICATOR-(in) USB_D+(io) USB_D-(io) CANL_EM(io) CANH_EM(io)

### Library data of the parts

## Module BMS_SEGMENT
Ports: ISOSPI_1M(io) ISOSPI_1P(io) ISOSPI_2P(io) ISOSPI_2M(io)

### Library data of the parts

## Module ENERGY_METER
Ports: HV+IN(in) HV-OUT(in) HV-IN(out) VCC(pwr) GND(pwr) CANH(io) CANL(io)

### Library data of the parts

## Module COOLING_MODULE
Ports: 12V+(in) GND(out)

### Library data of the parts

## Module BMS_SEGMENT_TEST
Ports: BMS_CELL_TEST_1(out) BMS_CELL_TEST_2(in) ISOSPI_1M(io) ISOSPI_1P(io) ISOSPI_2P(io) ISOSPI_2M(io) BMS_THERM_TEST_1(io) BMS_THERM_TEST_2(io)

### Library data of the parts

## Module MAIN_ECU
Ports: 12V_WHEEL_SPEED_FRONT_LEFT(pwr) WHEEL_SPEED_FRONT_LEFT(in) WHEEL_SPEED_FRONT_RIGHT(in) 12V_WHEEL_SPEED_FRONT_RIGHT(pwr) SHUTDOWN_E(out) INVERTER_SUPPLY(out) SIGNAL_CURRENT(in) GND_ACCEL_1(pwr) 5V_ACCEL_1(pwr) 12VSUPPLY_BRB(pwr) SIGNAL_ACCEL_2(in) 5V_ACCEL_2(pwr) GND_ACCEL_2(pwr) GND_DASH(pwr) CANL_DASH(io) CANH_DASH(io) 12V_DASH(in) FAN_1(out) 12V_ACCUM(pwr) BMS_OK(in) IMD_OK(in) GND_BRAKE_1(pwr) 5V_BRAKE_1(pwr) SIGNAL_BRAKE_1(in) SIGNAL_BRAKE_2(in) 5V_BRAKE_2(pwr) GND_BRAKE_2(pwr) CANL_ACCUM(io) CANH_ACCUM(io) GND_ACCUM(pwr) WHEEL_SPEED_REAR_RIGHT(in) WHEEL_SPEED_REAR_LEFT(in) BRAKE_LIGHT(out) GND_MAINT(pwr) 12V_WHEEL_SPEED_REAR_RIGHT(pwr) 12V_WHEEL_SPEED_REAR_LEFT(pwr) LATCH_EXT_BTN(in) GND(pwr) SIGNAL_ACCEL_1(in) GND_RADIATOR(pwr) FAN_2(out)

### Library data of the parts

## Module BEI_9360
Ports: GND_SENSOR_2(pwr) GND_SENSOR_1(pwr) SIGNAL_SENSOR_1(out) SIGNAL_SENSOR_2(out) 5V_SENSOR_2(pwr) 5V_SENSOR_1(pwr)

### Library data of the parts

## Module TE_M3031
Ports: 5V(pwr) GND(pwr) SIGNAL(out)

### Library data of the parts

## Module POWER_SWITCHING
Ports: OUT_1(out) OUT_2(out) GLV_BATTERY(in) GLV_BATTERY_2(in) DCDC(in) DCDC_2(in) START(in) AFTER_BRB(in) GND(pwr)

### Library data of the parts

## Module ACU
Ports: IM(io) IP(io) USB_GND(io) USB_D-(io) USB_D+(io) USB_VCC(io) CHASSIS_GND(io) TSAL_GREEN(io) TSAL_RED(io) SHDN_IN(io) BSPD_CURRENT(io) AMS_OK(io) IMD_OK(io) GND(io) CANL(io) CANH(io) 12V(io) CUR_GND(io) CUR_REF(io) CUR_SENSE(io) CUR_5V(io) OKHS(io) MHS(io) ACCUMULATOR_GND(io) CHASSIS_GND_IMD(io) 12V_IMD(io) GND_IMD(io) CANL_EM(io) CANH_EM(io) GND_EM(io) 12V_EM(io) PRECHARGE_OK(io) SHUTDOWN(io) 12V_TSB(io) SHDN1_TSB(io) PRECHARGE_OK_TSB(io) SHDN2_TSB(io) IP+(io) IP-(io) IM+(io) IM-(io)

### Library data of the parts

## Module DASHBOARD
Ports: 12V(io) CANL(io) CANH(io) SHUTDOWN_H(io) SHUTDOWN_G(io) SHUTDOWN_F(io) GND(io) BTN_GND(io) BTN_MARK(io) BTN_MC_CYCLE(io) BTN_MODE(io) BTN_START(io) BTN_LAUNCH(io)

### Library data of the parts

## Module TSB
Ports: DCDC-1(io) DCDC-2(io) DCDC+1(io) DCDC+2(io) 12V_ACU(io) SHDN1_ACU(io) PRECHARGE_OK_ACU(io) SHDN2_ACU(io) IP+(io) IP-(io) IM+(io) IM-(io) TS+_FUSED(io) TS-_FUSED(io) TS+_IMD(io) TS-_IMD(io) TSMP+(io) TSMP-(io) TS+_UNFUSED(io) LED+(io) TS-_FUSED_LED(io) PACK+(io) TS+_METER(io)

### Library data of the parts

## Module TSAL
Ports: 12V(io) GND_RED(io) GND_GREEN(io)

### Library data of the parts

## Module CUR_SENSE
Ports: GND(io) REF(io) SENSE(io) 5V(io) BSPD-(io) BSPD+(io)

### Library data of the parts